# Altium schematic sheet Main Schematic.SchDoc: Main Schematic
size 431 x 279 mm; DrawnBy: DD; DocumentNumber: GHL-1-21001; Revision: D; SheetNumber: 1; SheetTotal: 1; ProjectID: 263-03
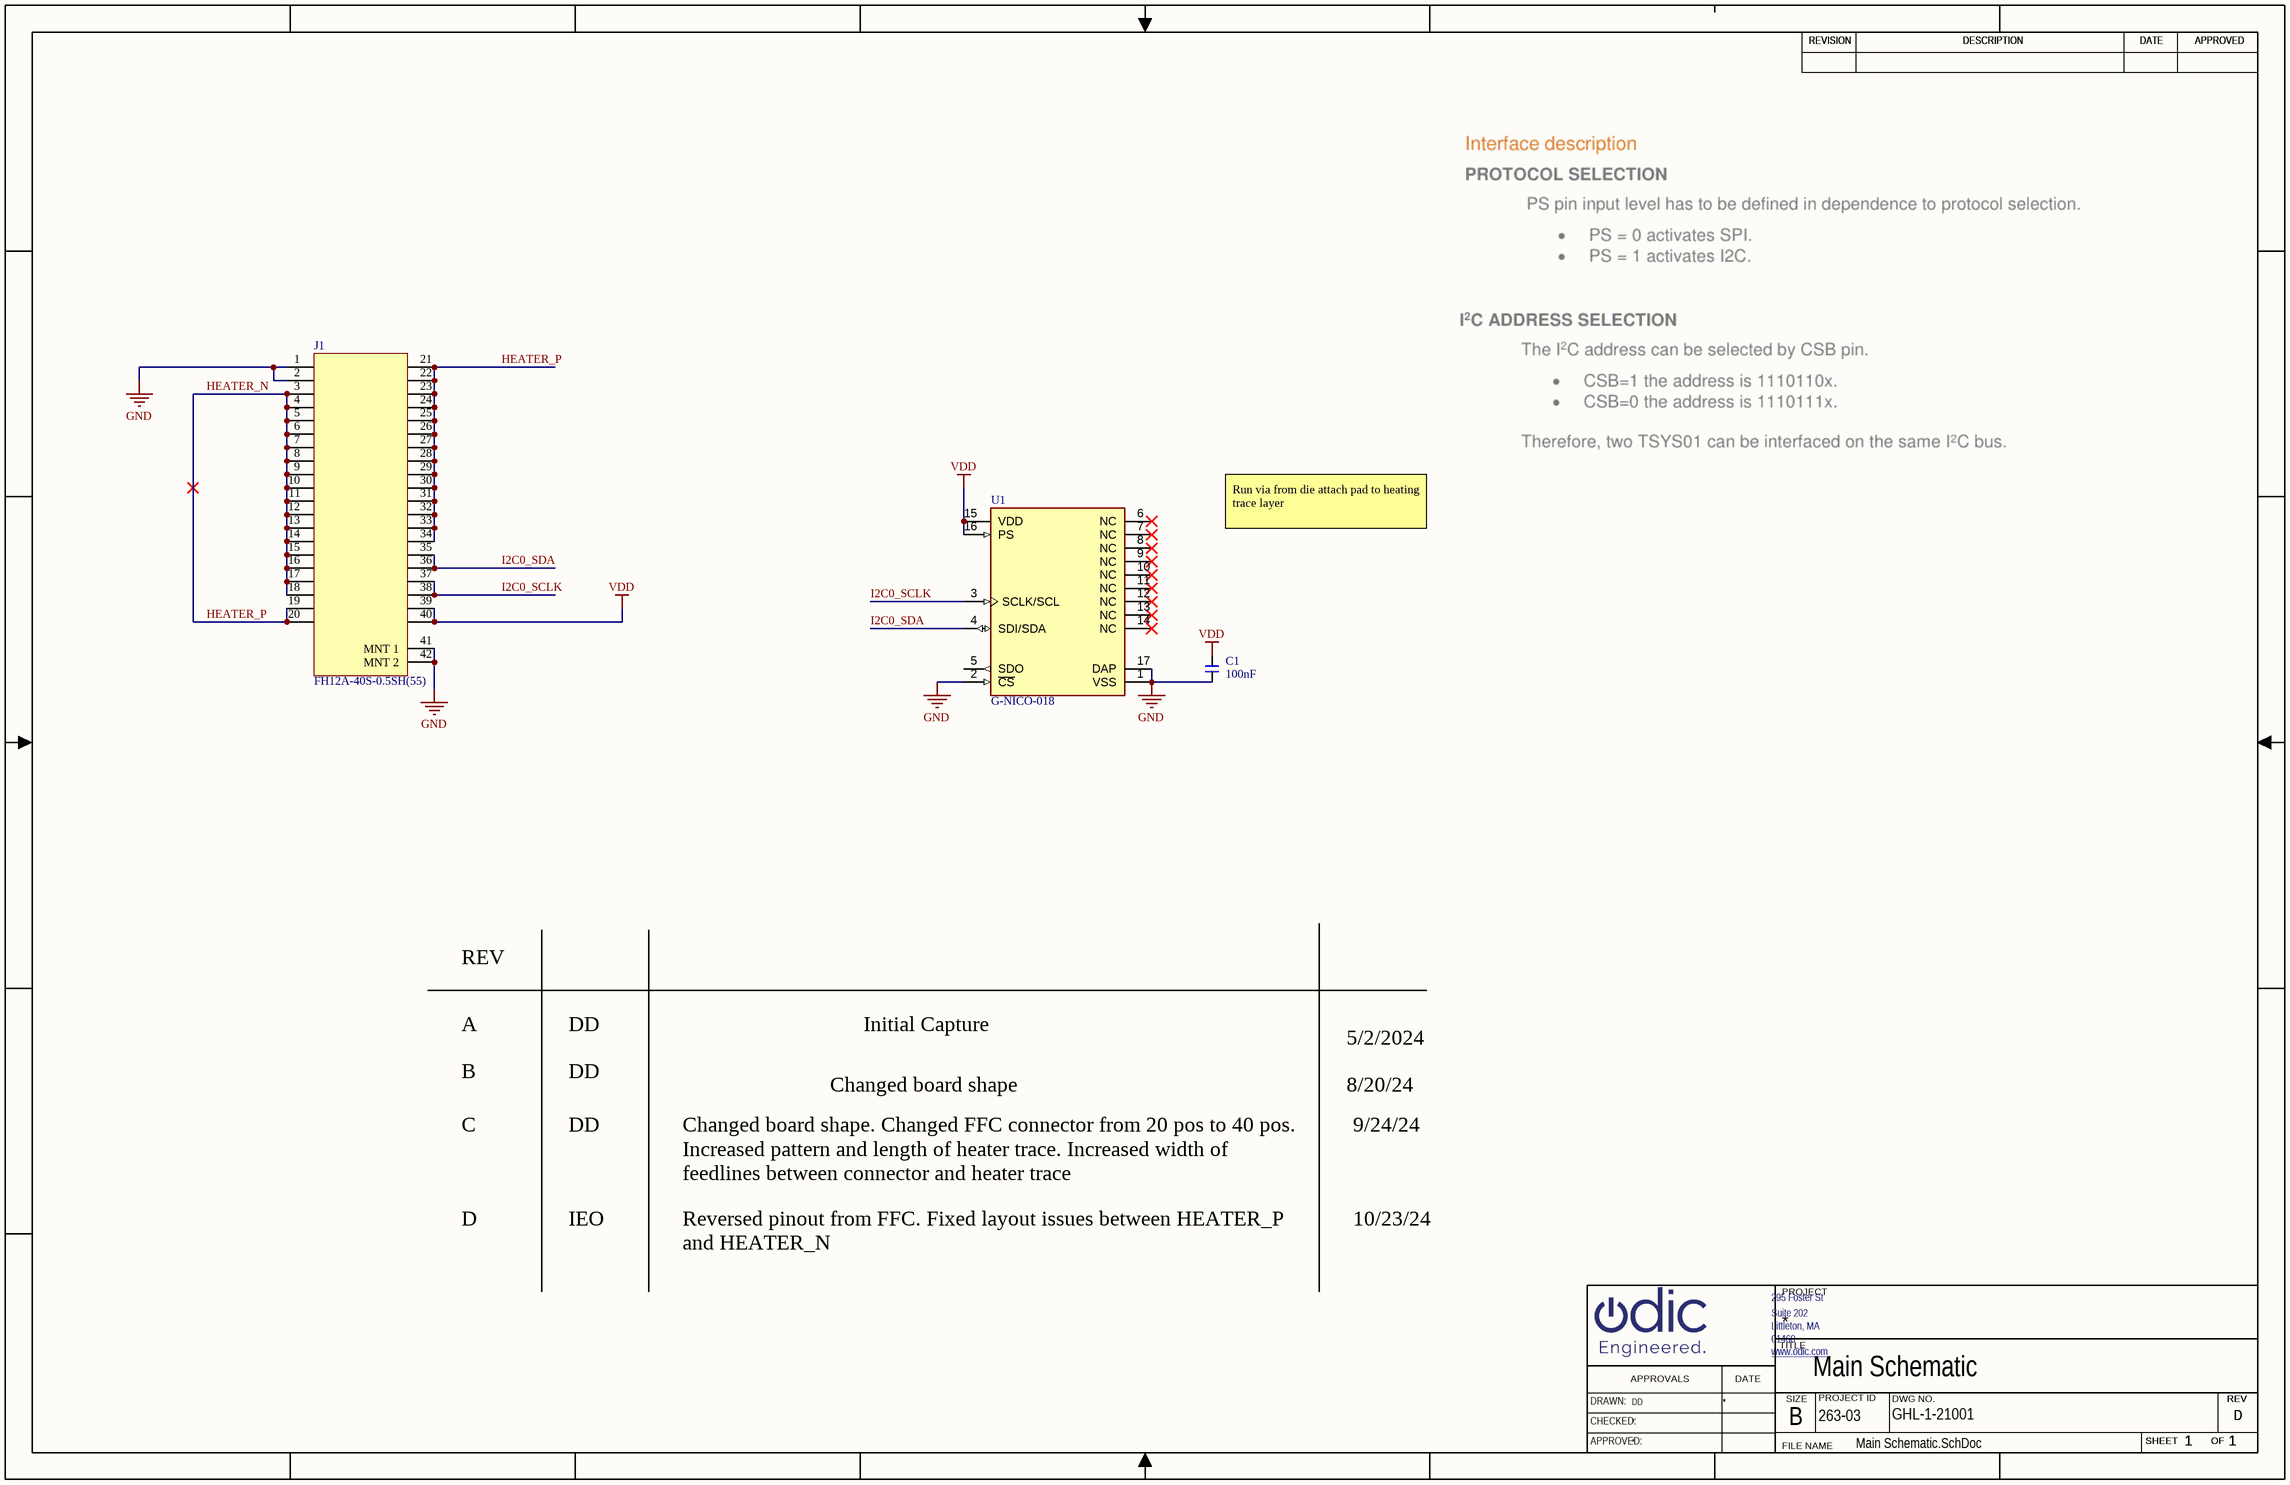
[diagram p0: Main Schematic.SchDoc]

## Parts
C1  100nF  [C0402]
J1  FH12A-40S-0.5SH(55)  [hirose_fh12a-40s-0p5sh55]
U1  G-NICO-018  [QFN16_4X4_P65mm]

## Nets
GND: C1.1 J1.1 J1.2 J1.41(MNT_1) J1.42(MNT_2) U1.1(VSS) U1.2(~{CS}) U1.17(DAP)
VDD: C1.2 J1.39 J1.40 U1.15(VDD) U1.16(PS)
HEATER_N: J1.3 J1.4 J1.5 J1.6 J1.7 J1.8 J1.9 J1.10 J1.11 J1.12 J1.13 J1.14 J1.15 J1.16 J1.17 J1.18 J1.19 J1.20 J1.21 J1.22 J1.23 J1.24 J1.25 J1.26 J1.27 J1.28 J1.29 J1.30 J1.31 J1.32 J1.33 J1.34  [also labelled HEATER_P]
I2C0_SCLK: J1.37 J1.38 U1.3(SCLK/SCL)
I2C0_SDA: J1.35 J1.36 U1.4(SDI/SDA)

Not connected (* = marked no-connect by the designer): U1 5(SDO) 6(NC)* 7(NC)* 8(NC)* 9(NC)* 10(NC)* 11(NC)* 12(NC)* 13(NC)* 14(NC)*

## Notes on the sheet
- Run via from die attach pad to heating trace layer
- REV
- A
- DD
- Initial Capture
- B
- Changed board shape
- 5/2/2024
- 8/20/24
- C
- 9/24/24
- D
- IEO
- Changed board shape. Changed FFC connector from 20 pos to 40 pos. Increased pattern and length of heater trace. Increased width of feedlines between connector and heater trace
- 10/23/24
- Reversed pinout from FFC. Fixed layout issues between HEATER_P and HEATER_N
- REVISION
- DESCRIPTION
- DATE
- APPROVED
- 295 Foster St
- PROJECT
- www.odic.com <http://www.odic.com>
- Littleton, MA
- 01460
- Suite 202
- TITLE
- DRAWN:
- CHECKED:
- APPROVALS
- SIZE
- PROJECT ID
- DWG NO.
- SHEET
- OF
- APPROVED:
- FILE NAME

## Library data of the parts
C1 = CMP-00446-1: Ceramic capacitor SMD 0402 100nF 16V X7R 10%; Install: POP; Voltage: 16V; Mounting Technology: Surface Mount; Width: 0.02inch; Case Code (Metric): 1005; Package Quantity: 1; Depth: 0.5mm; RoHS Compliant: Yes; Length: 1mm; Tolerance: 10%; Value: 100nF; Radiation Hardening: No; Contact Plating: Tin; Packaging: Tape and Reel; Voltage Rating (DC): 16V; Thickness: 0.022inch; Case Code (Imperial): 0402; Case/Package: 0402; Min Operating Temperature: -55°C; Max Operating Temperature: 125°C; Voltage Rating: 16V; Height: 0.5mm; Series: CL; Material: Ceramic; Construction: Flat; Lead Free: Lead Free; Dielectric: X7R
J1 = CMP-002-00023-3: Conn Ffc/fpc Connector Skt 40 Pos 0.5MM Solder Ra SMD T/r / Conn Ffc Top 40POS 0.50MM R/a; Wire/Cable Type: Straight; Insulation Resistance: 500MR; Mating Cycles: 20; Gender: Female; Connector Type: Receptacle; Voltage Rating: 50V; Contact Resistance: 50mR; Current Rating: 500mA; Number of Positions: 40; Actuator Material: Polyphenylene; Contact Pitch: 500um; Actuator Color: Brown; Max Current Rating: 400mA; Radiation Hardening: No; Depth: 6.2mm; Max Operating Temperature: 70°C; Contact Material: Bronze; Flammability Rating: UL94 V-0; Length: 24.5mm; Contact Plating: Gold; Pitch: 0.5mm; Voltage Rating (AC): 50V; Housing Material: Polyamide; Series: FH12; Contact Voltage Rating (AC): 50V; Material: Polyamide; Max Voltage Rating (AC): 50V; Number of Contacts: 40; Housing Color: Beige; Lead Free: Lead Free; Min Operating Temperature: -40°C; RoHS Compliant: Yes; Number of Rows: 1; Reach SVHC Compliant: No; Color: Beige,Brown; Lead Pitch: 0.5mm; Termination: Solder; Width: 24.1mm; Package Quantity: 2000; Contact Location: Top; Orientation: Right Angle; Mounting Technology: Surface Mount; Packaging: Tape and Reel
U1 = CMP-00069-3: TSYS01 Series 3.6 V -40 to +125 SMT Digital Temperature Sensor - QFN-16; Max Supply Current: 12.5uA; Operating Supply Voltage: 3.6V; Length: 4mm; Min Operating Temperature: -40°C; Max Operating Temperature: 125°C; Height: 0.85mm; Case/Package: QFN; Lead Free: Lead Free; Sensor Type: Temperature; Width: 0.157inch; RoHS Compliant: Yes